# EasyEDA Pro project love_compass.eprj

# Schematic Schematic1
Create Date: 2024-05-30; Page Name: P1; Project Name: love_compass; Schematic Name: Schematic1; Update Date: 2024-05-30; Company: EasyEDA.com; Drawn: EasyEDA; Page Size: A4; Part Number: JLCPCB-002; Reviewed: EasyEDA; Version: V0.1
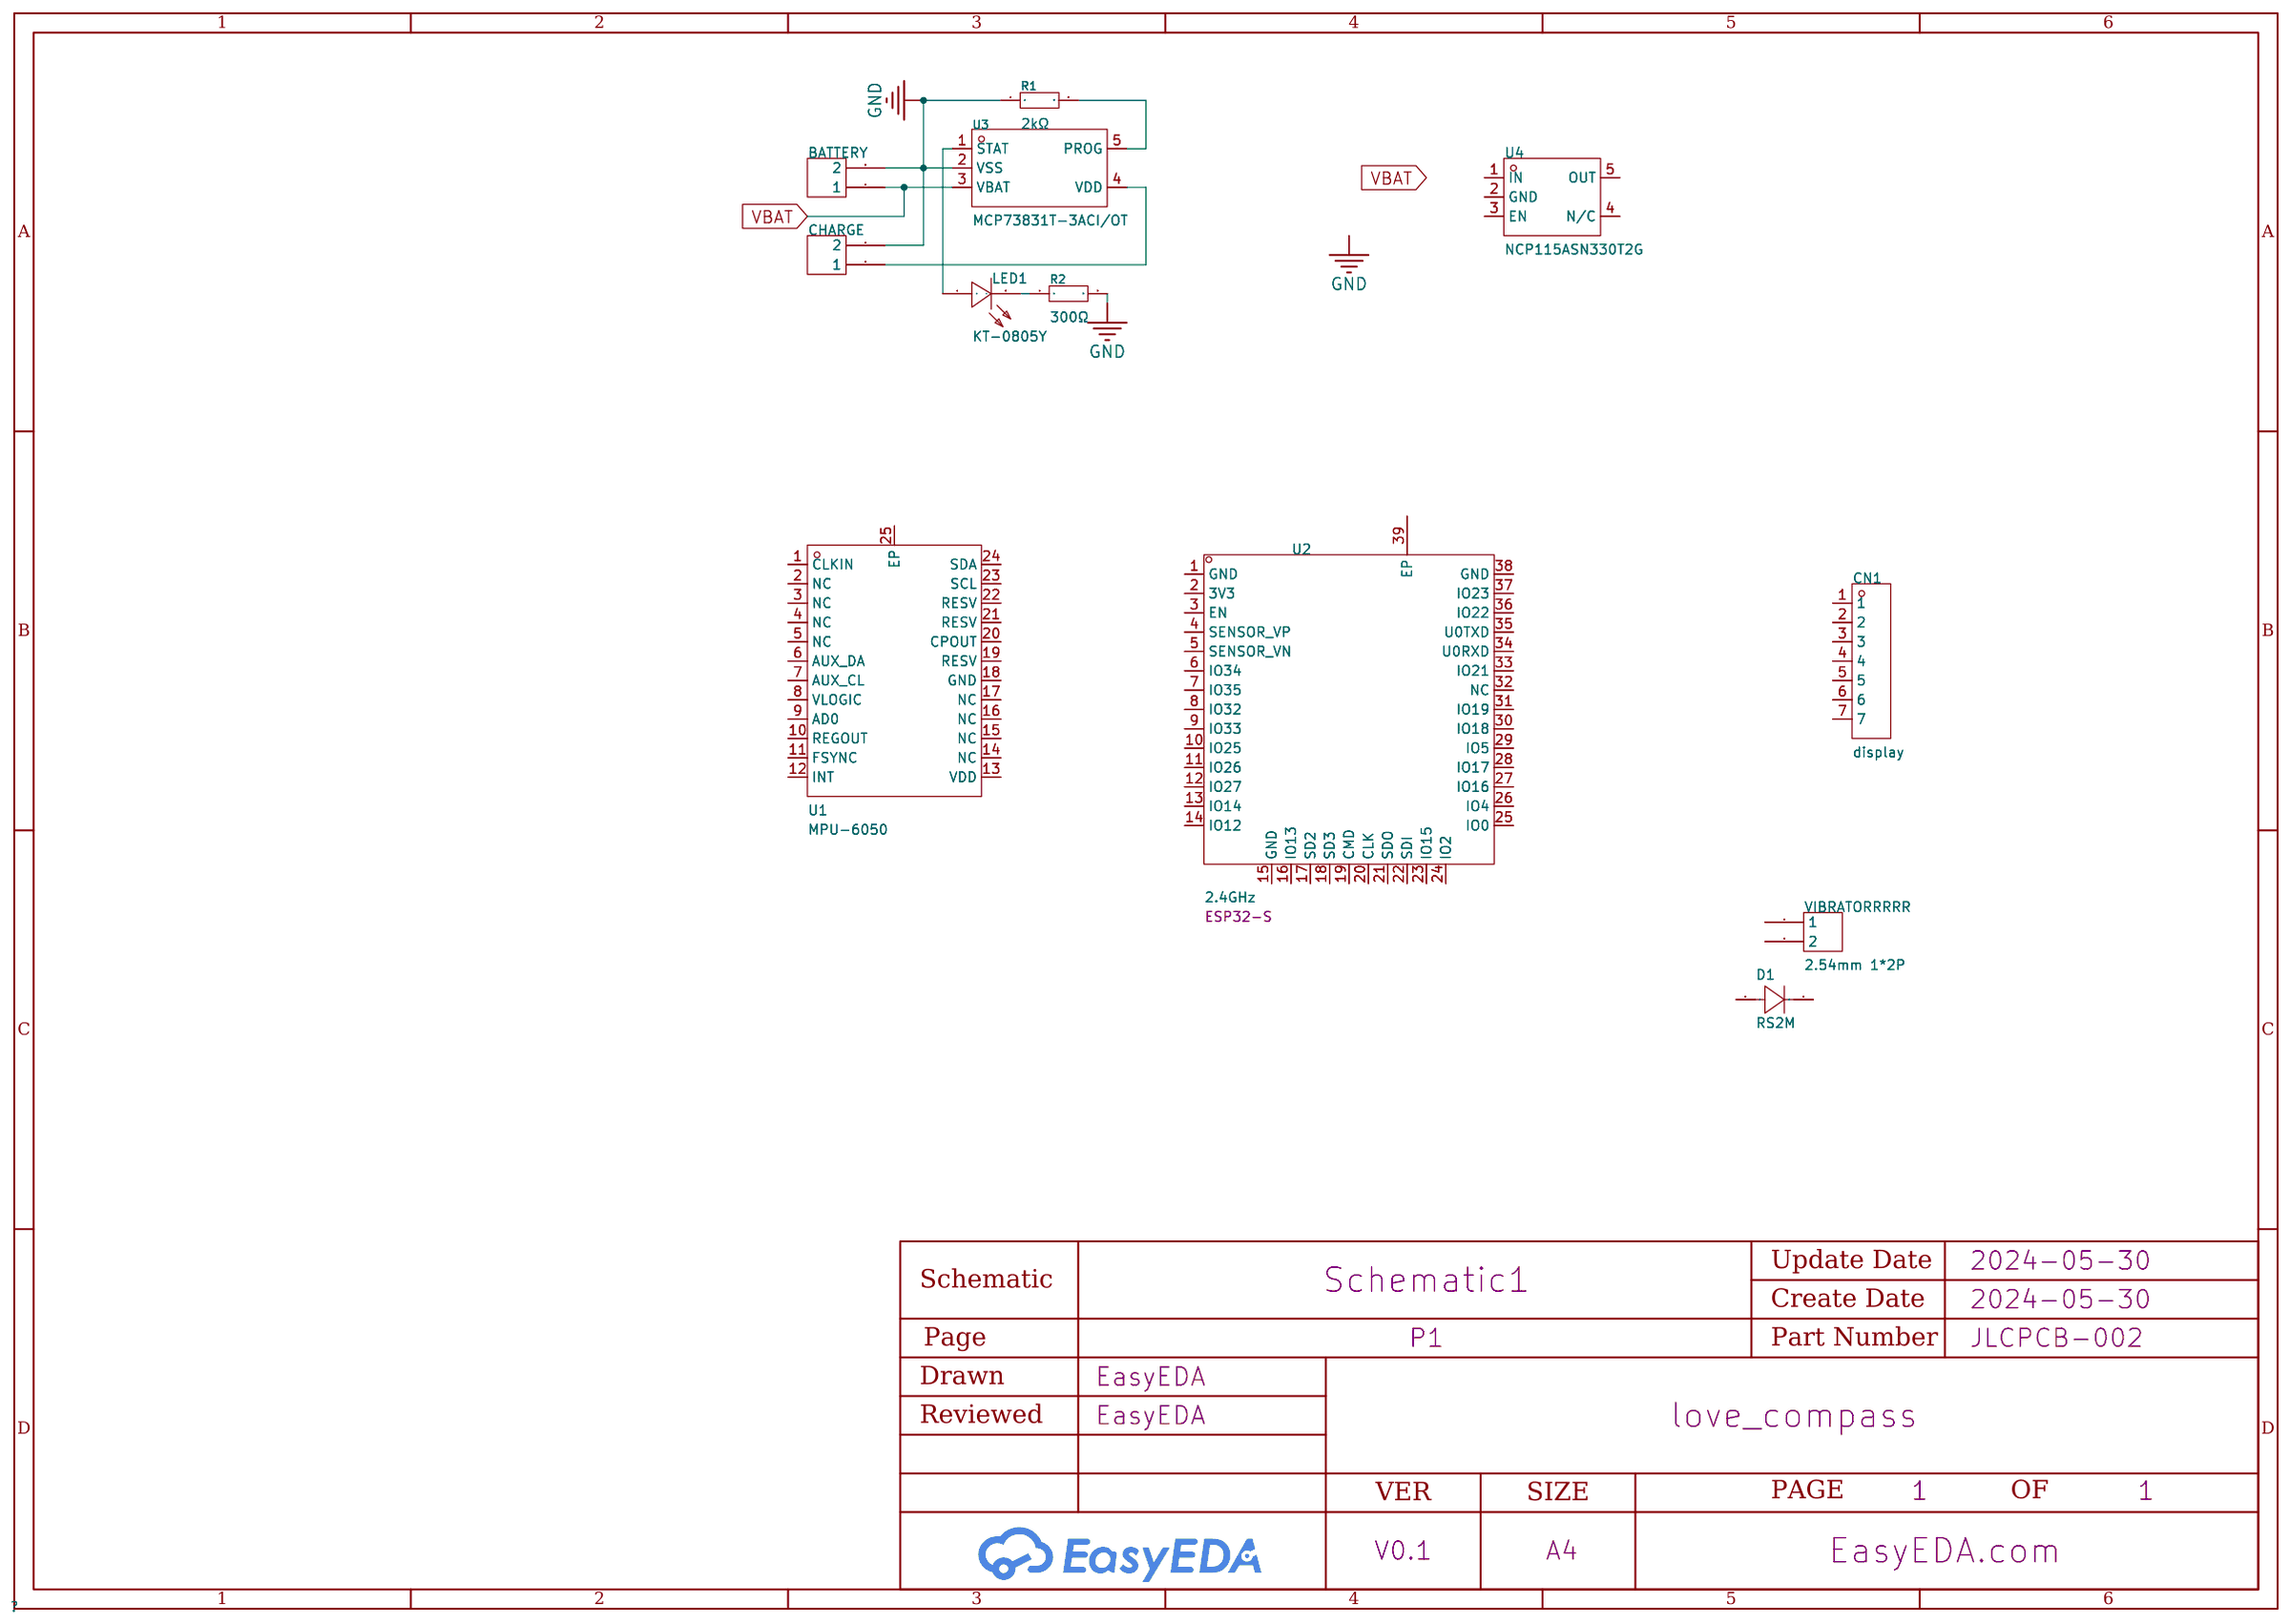
[diagram p0: schematic sheet]

## Parts
BATTERY  2.54mm 1*2P  [HDR-TH_2P-P2.54-V-M]
CHARGE  2.54mm 1*2P  [HDR-TH_2P-P2.54-V-M]
CN1  display  [CONN-TH_7P-P2.54_C9900012194]
D1  RS2M  [SMA-SMD_L4.4-W2.7-LS5.4-RD]
LED1  KT-0805Y  [LED0805-R-RD]
R1  2kΩ  [R0805]
R2  300Ω  [R0805]
U1  MPU-6050  [QFN-24_L4.0-W4.0-P0.50-BL-EP2.7]
U2  2.4GHz  [WIRELM-SMD_ESP32-S]
U3  MCP73831T-3ACI/OT  [SOT-23-5_L2.9-W1.6-P0.95-LS2.8-BR]
U4  NCP115ASN330T2G  [SOT-23-5_L3.0-W1.7-P0.95-LS2.8-BL]
VIBRATORRRRR  2.54mm 1*2P  [HDR-TH_2P-P2.54-V-M]

## Library data of the parts
BATTERY CHARGE VIBRATORRRRR = 2.54mm 1*2P: Circluar Pins/Square Pins:- Current Rating (Max):- Voltage Rating (Max):- Length of Mating Pin:- Insulation Height:- Contact Material:; LCSC Part Name: 2.54mm   1*2P; Supplier Part: C36717; Supplier Footprint: P=2.54mm; JLCPCB Part Class: Extended Part; Supplier: LCSC
CN1 = 1*7pin排间距2.54mm: Supplier Part: C9900012194; Supplier Footprint: 插件; JLCPCB Part Class: Extended Part; Supplier: LCSC
D1 = RS2M_1: Diode Configuration:独立式 Forward Voltage (Vf@If):1.3V@2A Reverse Voltage (Vr): Average Rectified Current (Io): Reverse Leakage Current:5uA@1kV Reverse Recovery Time (trr): Operating Temperature:-65℃~+150℃ Operating Temperature:-65℃~+150℃; LCSC Part Name: 电压:1kV 电流:2A; Supplier Part: C5199100; Manufacturer: HXY MOSFET(华轩阳电子); Supplier Footprint: SMA; JLCPCB Part Class: Extended Part; Datasheet: https://atta.szlcsc.com/upload/public/pdf/source/20230718/33D373A8DE4B393DF79DCF29610D4456.pdf; Supplier: LCSC; Diode Configuration: 独立式; Forward Voltage (Vf@If): 1.3V@2A; Reverse Leakage Current: 5uA@1kV; Operating Temperature: -65℃~+150℃
LED1 = KT-0805Y: Emitted Color:Yellow Power Dissipation:- Forward Current:- Dominant Wavelength:- Dominant Wavelength:- Peak Wavelength:- Diode Configuration:- Lens Color:- Color Temperature:- Color Temperature:- Viewing Angle:- Mounting Sytle:- Operating Temperature:- Op; LCSC Part Name: 0805 黄灯 高亮; Supplier Part: C2296; Manufacturer: KENTO; Supplier Footprint: 0805; JLCPCB Part Class: Basic Part; Datasheet: https://atta.szlcsc.com/upload/public/pdf/source/20160421/1461205044170.pdf; Supplier: LCSC; Emitted Color: Yellow
R1 = 0805W8F2001T5E: Type:Thick Film Resistors Resistance:2kΩ Tolerance:±1% Tolerance:±1% Power(Watts): Overload Voltage (Max): Temperature Coefficient:±100ppm/℃ Temperature Coefficient:±100ppm/℃ Operating Temperature Range:-55℃~+155℃ Operating Temperature Range:-55℃~+155℃; LCSC Part Name: 2kΩ ±1% 125mW 厚膜电阻; Supplier Part: C17604; Manufacturer: UNI-ROYAL(厚声); Supplier Footprint: 0805; JLCPCB Part Class: Basic Part; Datasheet: https://atta.szlcsc.com/upload/public/pdf/source/20200306/C422600_1E6D84923E4A46A82E41ADD87F860B5C.pdf; Supplier: LCSC; Type: Thick Film Resistors; Tolerance: ±1%; Temperature Coefficient: ±100ppm/℃; Operating Temperature Range: -55℃~+155℃
R2 = 0805W8F3000T5E: Type:Thick Film Resistors Resistance: Tolerance:±1% Tolerance:±1% Power(Watts): Overload Voltage (Max): Temperature Coefficient:±100ppm/℃ Temperature Coefficient:±100ppm/℃ Operating Temperature Range:-55℃~+155℃ Operating Temperature Range:-55℃~+155℃; LCSC Part Name: 300Ω ±1% 125mW 厚膜电阻; Supplier Part: C17617; Manufacturer: UNI-ROYAL(厚声); Supplier Footprint: 0805; JLCPCB Part Class: Basic Part; Datasheet: https://atta.szlcsc.com/upload/public/pdf/source/20200306/C422600_1E6D84923E4A46A82E41ADD87F860B5C.pdf; Supplier: LCSC; Type: Thick Film Resistors; Tolerance: ±1%; Temperature Coefficient: ±100ppm/℃; Operating Temperature Range: -55℃~+155℃
U1 = MPU-6050: Sensor Type:加速度计陀螺仪 Operating Temperature:-40℃~+85℃ Operating Temperature:-40℃~+85℃; Supplier Part: C24112; Manufacturer: TDK InvenSense(应美盛); Supplier Footprint: QFN-24-EP(4x4); JLCPCB Part Class: Extended Part; Datasheet: https://atta.szlcsc.com/upload/public/pdf/source/20140425/1457707046159.pdf; Supplier: LCSC; Sensor Type: 加速度计陀螺仪; Operating Temperature: -40℃~+85℃
U2 = ESP32-S: Core Processor:ESP32芯片 Wireless Standard:- Support Interface:I2C；UART；DAC；SPI；PWM；ADC Frequency:2.4GHz Antenna Type:IPEX接口 Output Power:17dBm Output Power:17dBm Operating Voltage:3.3V Operating Voltage:3.3V Receive  Current:- Send  Current:- Sensitivity:-; Supplier Part: C277944; Manufacturer: Ai-Thinker(安信可); Supplier Footprint: SMD; JLCPCB Part Class: Extended Part; Datasheet: https://atta.szlcsc.com/upload/public/pdf/source/20211217/F4BEA33E732D6002D10DAED85BBCB52B.pdf; Supplier: LCSC; Core Processor: ESP32芯片; Support Interface: I2C；UART；DAC；SPI；PWM；ADC; Antenna Type: IPEX接口; Output Power: 17dBm; Operating Voltage: 3.3V; Sensitivity: -90dBm; Operating Temperature: -40℃~+85℃
U3 = MCP73831T-3ACI/OT: Supply Voltage:6V Supply Voltage:6V Maximum Charge Current:500mA Type of Battery:锂离子/Polymer Number of Cells:1 Number of Cells:1 Operating Temperature:-40℃~+85℃ Operating Temperature:-40℃~+85℃; Supplier Part: C625598; Manufacturer: MICROCHIP(美国微芯); Supplier Footprint: SOT-23-5; JLCPCB Part Class: Extended Part; Datasheet: https://atta.szlcsc.com/upload/public/pdf/source/20200824/C623846_A0511C3234D8E8E5A840FF446B3172EE.pdf; Supplier: LCSC; Supply Voltage: 6V; Maximum Charge Current: 500mA; Type of Battery: 锂离子/Polymer; Number of Cells: 1; Operating Temperature: -40℃~+85℃
U4 = NCP115ASN330T2G: Output Type:固定 Maximum Input Voltage:5.5V Output Voltage:3.3V Output Voltage:3.3V MAX Output Current:300mA Power Supply Rejection Ratio (PSRR):70dB@(1kHz) Dropout Voltage:280mV@(300mA) standby current:95uA Operating Temperature:-40℃~+85℃@(Tj) Operating Te; LCSC Part Name: LDO 稳压器，300 mA，超低 Iq，高 PSRR，高准确度; Supplier Part: C603505; Manufacturer: onsemi(安森美); Supplier Footprint: TSOP-5; JLCPCB Part Class: Extended Part; Datasheet: https://atta.szlcsc.com/upload/public/pdf/source/20200827/C603499_936EE7D9D743C8CA5BCBC43ECDFEB2DC.pdf; Supplier: LCSC; Output Type: 固定; Maximum Input Voltage: 5.5V; Output Voltage: 3.3V; MAX Output Current: 300mA; Power Supply Rejection Ratio (PSRR): 70dB@(1kHz); Dropout Voltage: 280mV@(300mA); standby current: 95uA; Operating Temperature: -40℃~+85℃@(Tj); Output Polarity: Positive electrode; Number of Outputs: 1

## Nets
GND: BATTERY.2 CHARGE.2 R1.1 R2.2 U3.2(VSS)
VBAT: BATTERY.1 U3.3(VBAT)
Net-(CHARGE-1): CHARGE.1 U3.4(VDD)
Net-(LED1-1): LED1.1(+) U3.1(STAT)
Net-(LED1-2): LED1.2(-) R2.1
Net-(R1-2): R1.2 U3.5(PROG)

Not connected (* = marked no-connect by the designer): CN1 1 2 3 4 5 6 7; D1 1(K) 2(A); U1 1(CLKIN) 2(NC) 3(NC) 4(NC) 5(NC) 6(AUX_DA) 7(AUX_CL) 8(VLOGIC) 9(AD0) 10(REGOUT) 11(FSYNC) 12(INT) 13(VDD) 14(NC) 15(NC) 16(NC) 17(NC) 18(GND) 19(RESV) 20(CPOUT) 21(RESV) 22(RESV) 23(SCL) 24(SDA) 25(EP); U2 1(GND) 2(3V3) 3(EN) 4(SENSOR_VP) 5(SENSOR_VN) 6(IO34) 7(IO35) 8(IO32) 9(IO33) 10(IO25) 11(IO26) 12(IO27) 13(IO14) 14(IO12) 15(GND) 16(IO13) 17(SD2) 18(SD3) 19(CMD) 20(CLK) 21(SDO) 22(SDI) 23(IO15) 24(IO2) 25(IO0) 26(IO4) 27(IO16) 28(IO17) 29(IO5) 30(IO18) 31(IO19) 32(NC) 33(IO21) 34(U0RXD) 35(U0TXD) 36(IO22) 37(IO23) 38(GND) 39(EP); U4 1(IN) 2(GND) 3(EN) 4(N/C) 5(OUT); VIBRATORRRRR 1 2
